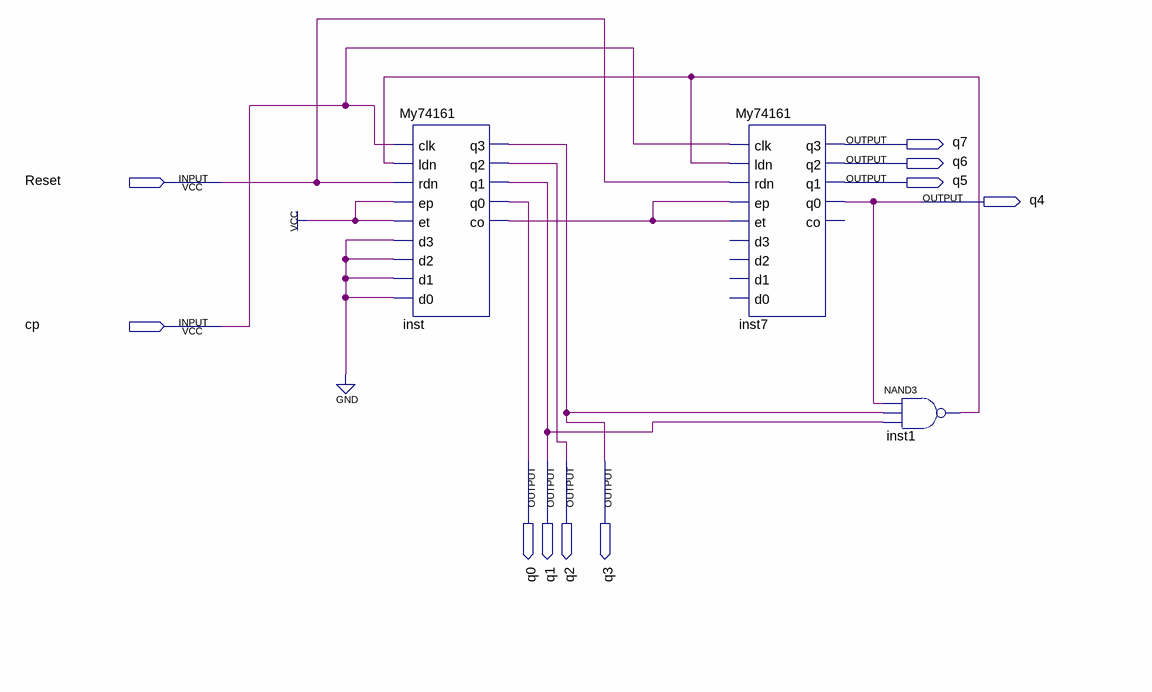
[diagram p0: schematic sheet]
// Quartus schematic exp3_2.bdf as structural Verilog: 3 symbols, 10 pins
module exp3_2 (
  input  Reset,
  input  cp,
  output q7,
  output q6,
  output q5,
  output q4,
  output q0,
  output q1,
  output q2,
  output q3
);

  wire inst1_out, inst_co;

  My74161 inst (
    .clk(cp), .ldn(inst1_out), .rdn(Reset), .ep(1'b1), .et(1'b1), .d3(1'b0), .d2(1'b0), .d1(1'b0), .d0(1'b0),
    .q3(q3), .q2(q2), .q1(q1), .q0(q0), .co(inst_co));
  My74161 inst7 (
    .clk(cp), .ldn(inst1_out), .rdn(Reset), .ep(inst_co), .et(inst_co), .q3(q7), .q2(q6), .q1(q5), .q0(q4));  // open: d3, d2, d1, d0, co
  nand inst1 (inst1_out, q4, q3, q1);
endmodule
